# Altium schematic sheet 07) DIGITAL TRANSLATION.SchDoc
size 701 x 447 mm
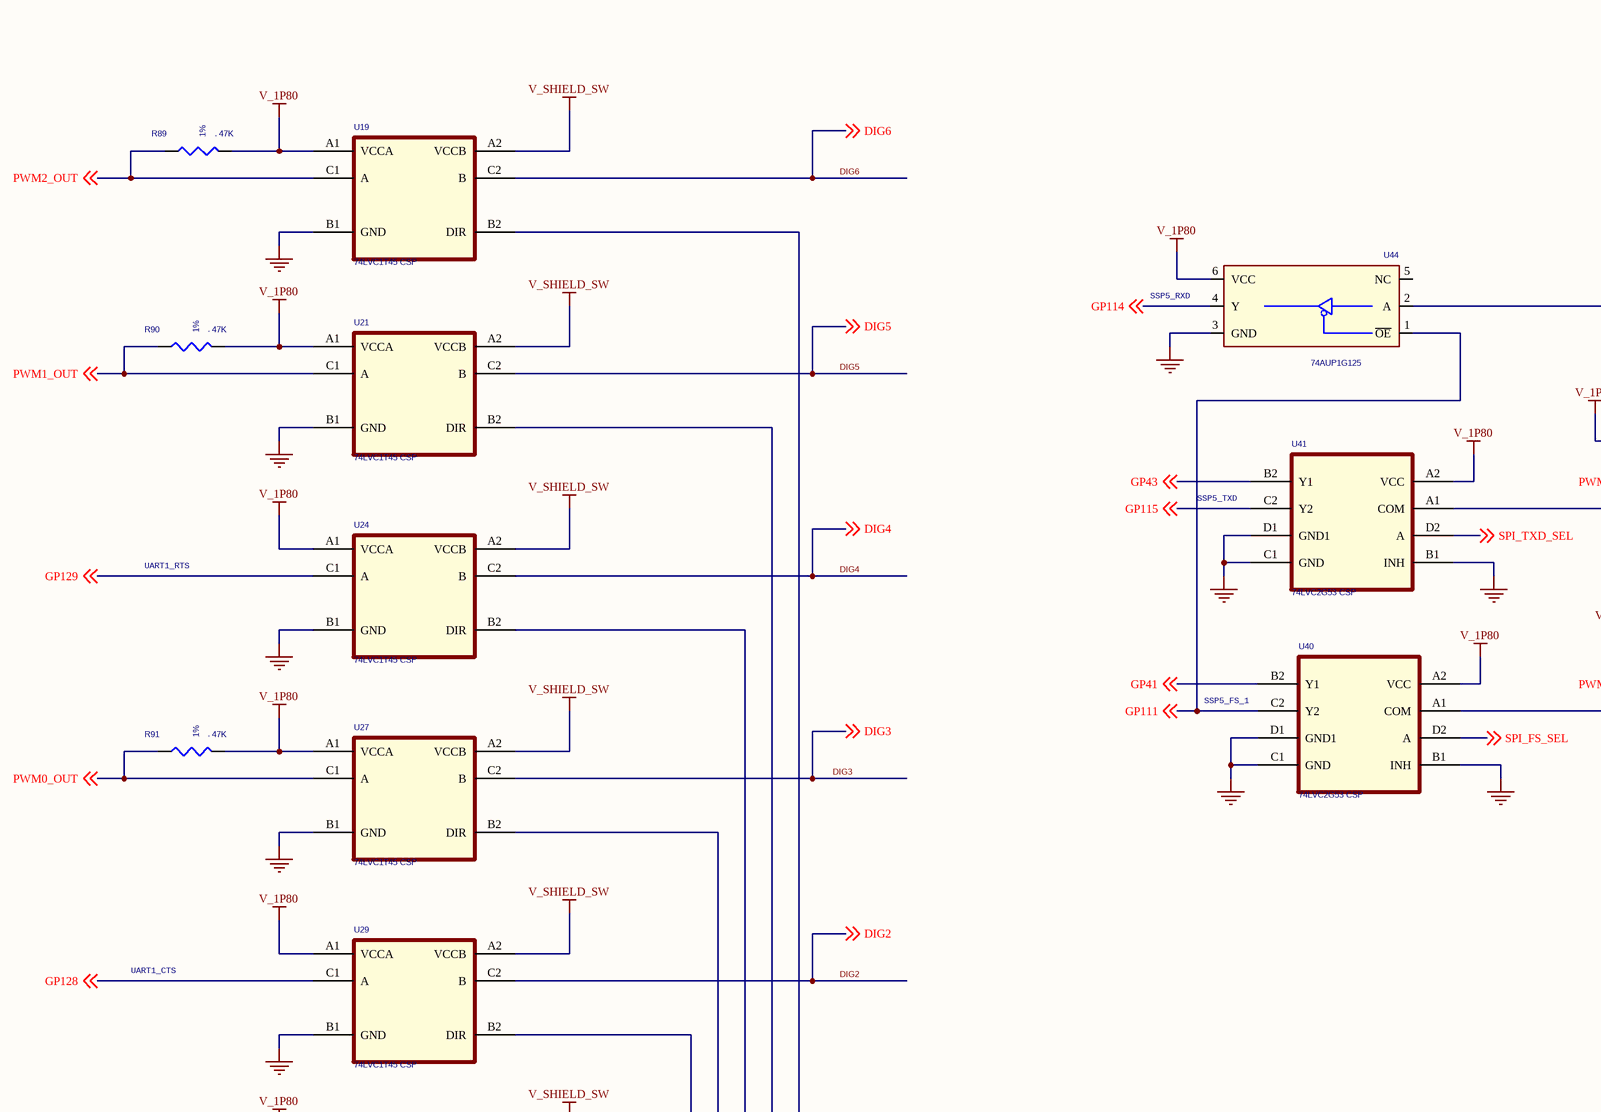
[diagram p0: 07) DIGITAL TRANSLATION.SchDoc, top left]
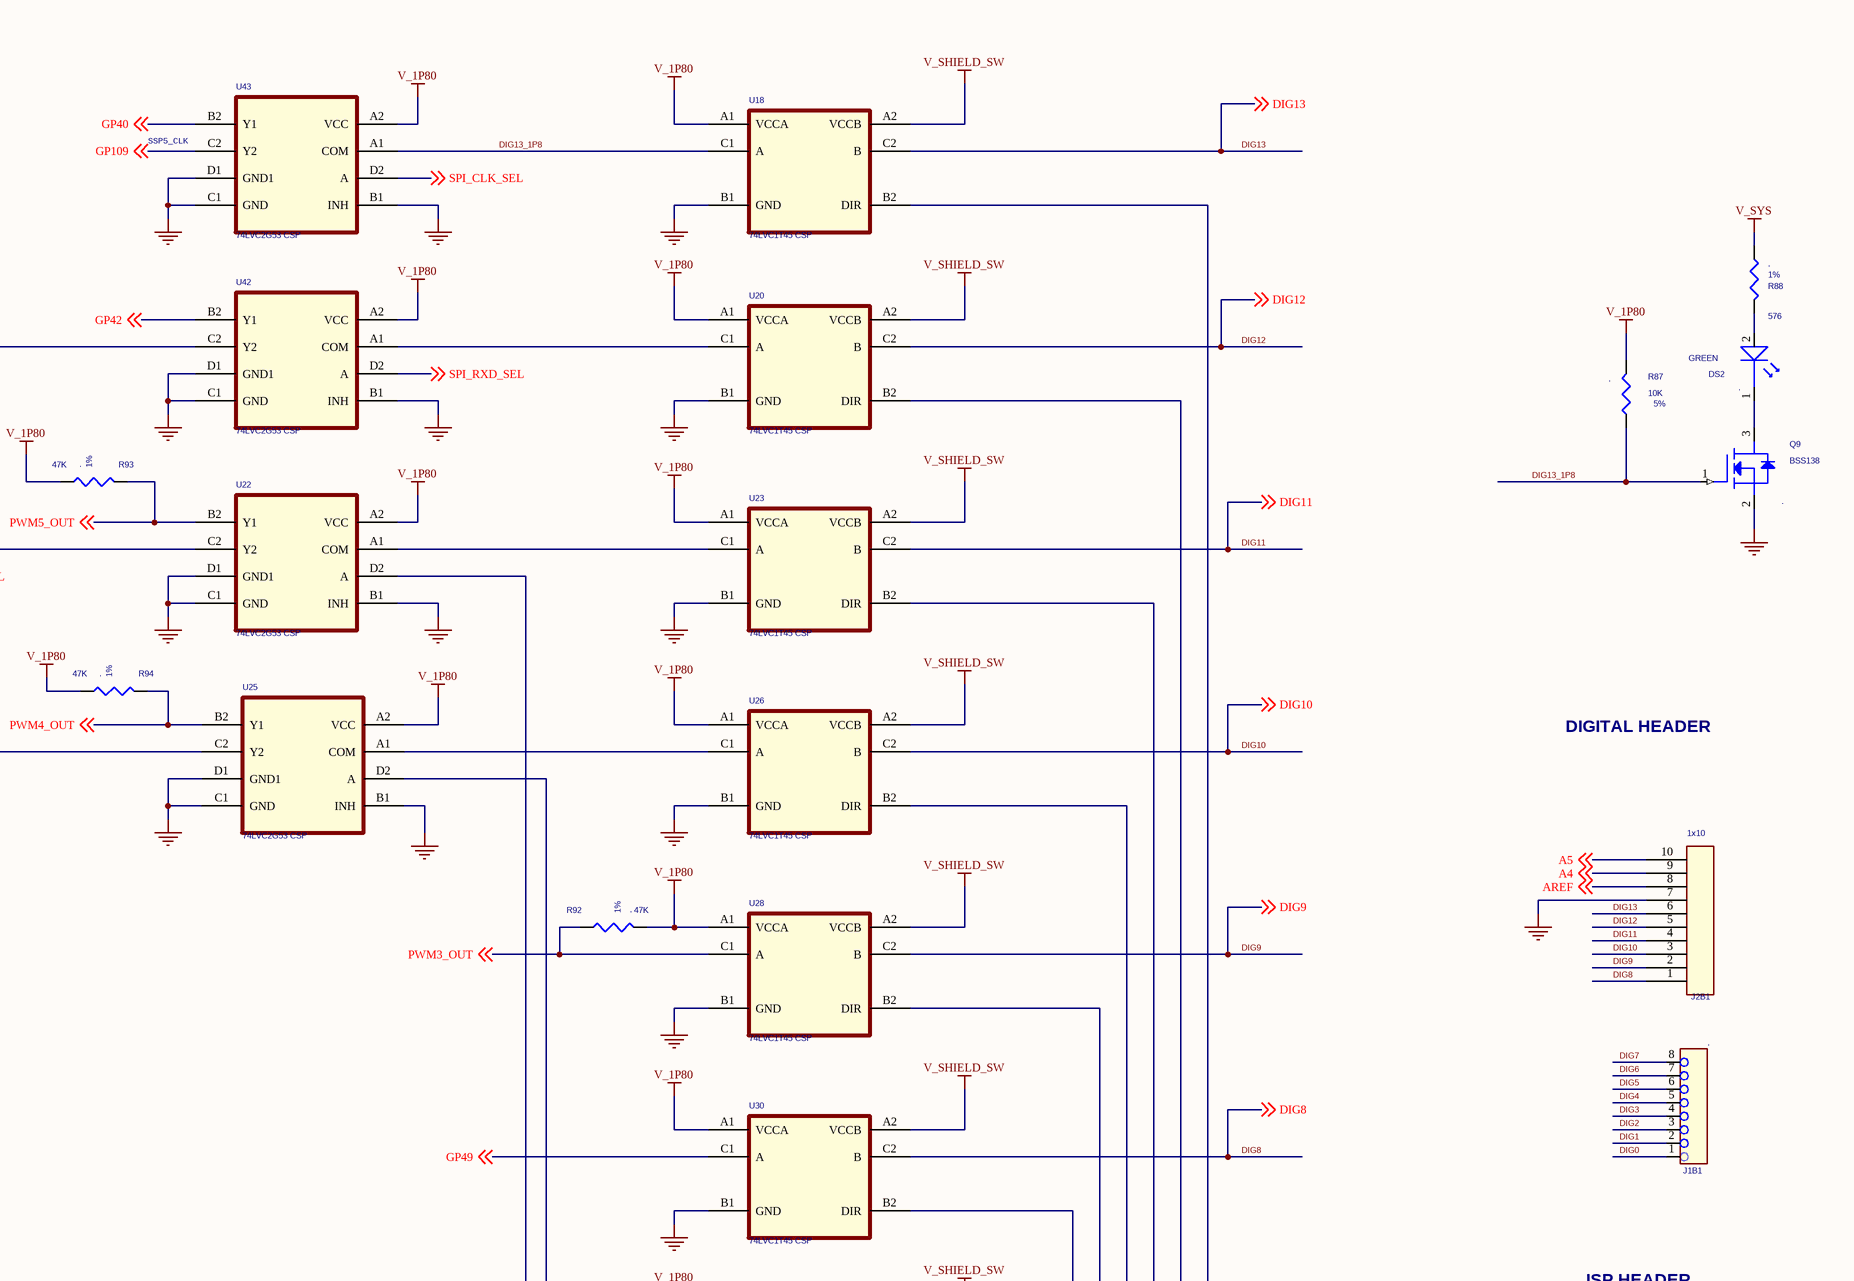
[diagram p1: 07) DIGITAL TRANSLATION.SchDoc, top right]
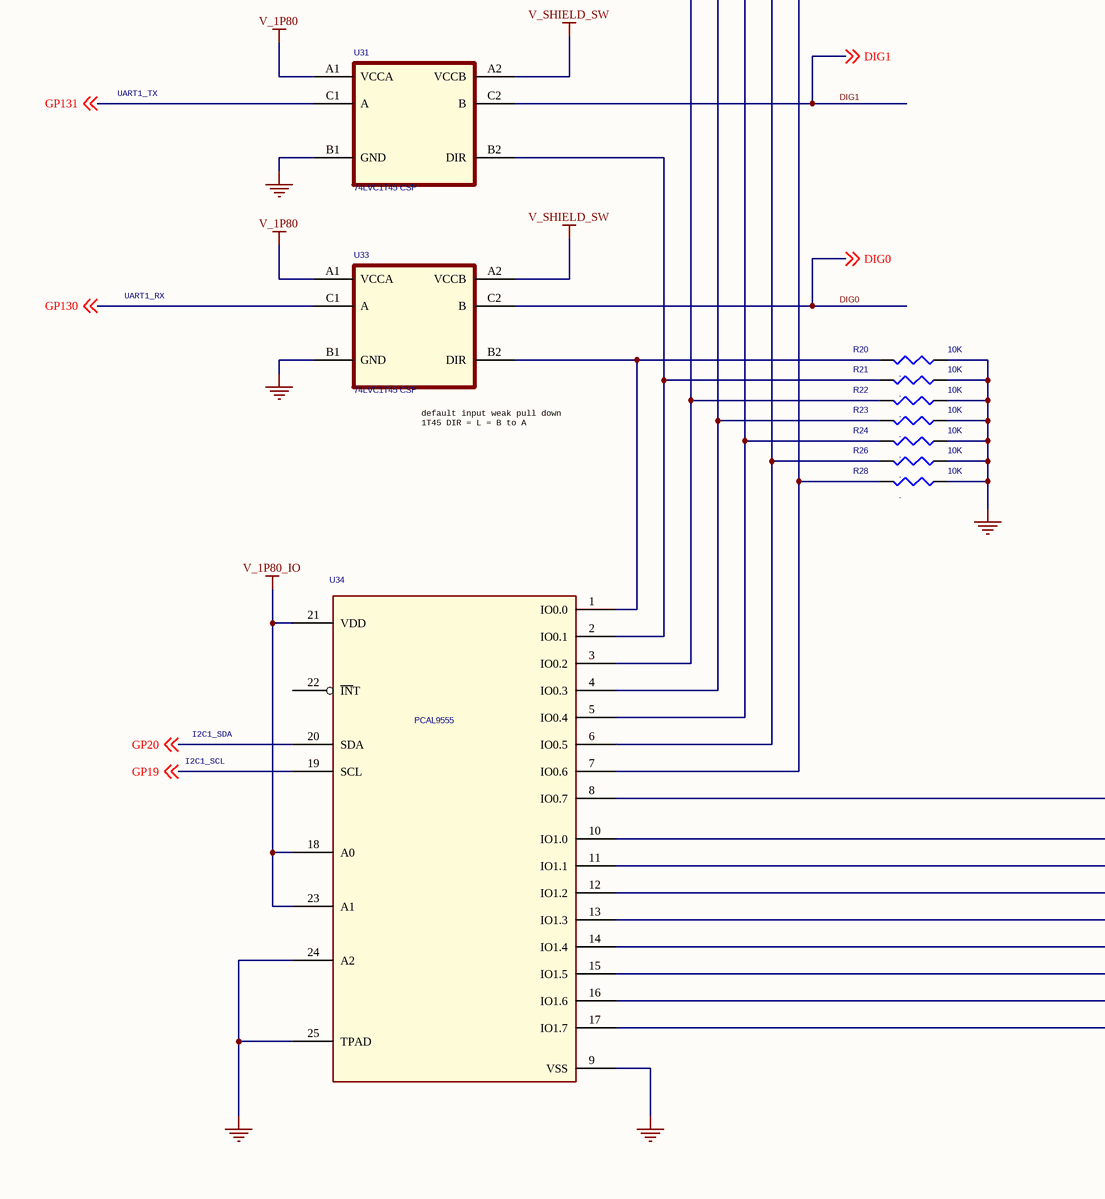
[diagram p2: 07) DIGITAL TRANSLATION.SchDoc, bottom left]
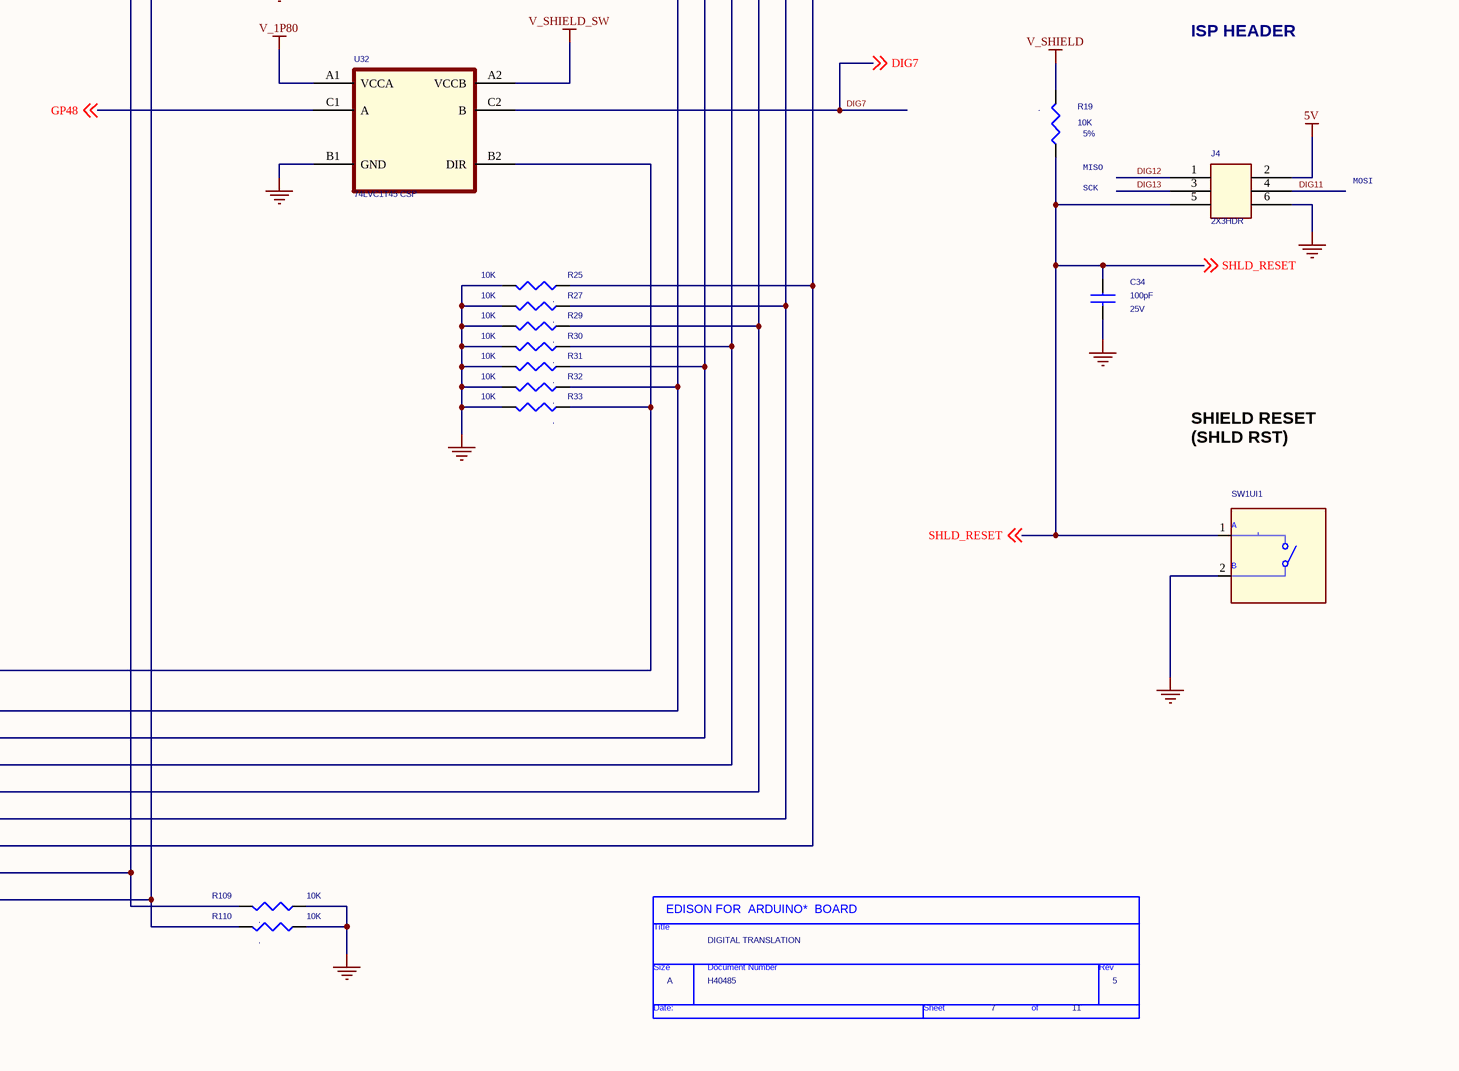
[diagram p3: 07) DIGITAL TRANSLATION.SchDoc, bottom right]

## Parts
*  Page Count: 11  Page Number: 7  Page Size: A  Title: DIGITAL TRANSLATION  RevCode: 5  Doc: H40485  (hidden comment: TitleBlock0)  (graphical)
C34  100pF  RATING: 25V  [SMC0201]
DS2  GREEN  NO_STUFF: .  [smled0402]
J1B1  NO_STUFF: .  [1x8hdr_p100in_th]  (hidden comment: CON8_HDR)
J2B1  1x10  [con10_1x10]
J4  2X3HDR  [HDR_2X3DP]
Q9  BSS138  NO_STUFF: .  [SOT23]
R19  10K  NO_STUFF: .  TOL: 5%  [SMR0201]
R20  10K  NO_STUFF: .  [SMR0201]
R21  10K  NO_STUFF: .  [SMR0201]
R22  10K  NO_STUFF: .  [SMR0201]
R23  10K  NO_STUFF: .  [SMR0201]
R24  10K  NO_STUFF: .  [SMR0201]
R25  10K  NO_STUFF: .  [SMR0201]
R26  10K  NO_STUFF: .  [SMR0201]
R27  10K  NO_STUFF: .  [SMR0201]
R28  10K  NO_STUFF: .  [SMR0201]
R29  10K  NO_STUFF: .  [SMR0201]
R30  10K  NO_STUFF: .  [SMR0201]
R31  10K  NO_STUFF: .  [SMR0201]
R32  10K  NO_STUFF: .  [SMR0201]
R33  10K  NO_STUFF: .  [SMR0201]
R87  10K  NO_STUFF: .  TOL: 5%  [SMR0201]
R88  576  NO_STUFF: .  TOL: 1%  [SMR0201]
R89  47K  TOL: 1%  NO_STUFF: .  [SMR0201]
R90  47K  TOL: 1%  NO_STUFF: .  [SMR0201]
R91  47K  TOL: 1%  NO_STUFF: .  [SMR0201]
R92  47K  TOL: 1%  NO_STUFF: .  [SMR0201]
R93  47K  TOL: 1%  NO_STUFF: .  [SMR0201]
R94  47K  TOL: 1%  NO_STUFF: .  [SMR0201]
R109  10K  NO_STUFF: .  [SMR0201]
R110  10K  NO_STUFF: .  [SMR0201]
SW1UI1  LIGHT TOUCH SWITCH EVQP7J01P  [sw_evqp7_4p]  (value not drawn)
U18  74LVC1T45 CSP  [bga6_5mm_37x57]
U19  74LVC1T45 CSP  [bga6_5mm_37x57]
U20  74LVC1T45 CSP  [bga6_5mm_37x57]
U21  74LVC1T45 CSP  [bga6_5mm_37x57]
U22  74LVC2G53 CSP  [bga8_2X4_P5MM]
U23  74LVC1T45 CSP  [bga6_5mm_37x57]
U24  74LVC1T45 CSP  [bga6_5mm_37x57]
U25  74LVC2G53 CSP  [bga8_2X4_P5MM]
U26  74LVC1T45 CSP  [bga6_5mm_37x57]
U27  74LVC1T45 CSP  [bga6_5mm_37x57]
U28  74LVC1T45 CSP  [bga6_5mm_37x57]
U29  74LVC1T45 CSP  [bga6_5mm_37x57]
U30  74LVC1T45 CSP  [bga6_5mm_37x57]
U31  74LVC1T45 CSP  [bga6_5mm_37x57]
U32  74LVC1T45 CSP  [bga6_5mm_37x57]
U33  74LVC1T45 CSP  [bga6_5mm_37x57]
U34  PCAL9555  [LCC25_S41_5DF89X89MA]
U40  74LVC2G53 CSP  [bga8_2X4_P5MM]
U41  74LVC2G53 CSP  [bga8_2X4_P5MM]
U42  74LVC2G53 CSP  [bga8_2X4_P5MM]
U43  74LVC2G53 CSP  [bga8_2X4_P5MM]
U44  74AUP1G125  [LCC6_P35MM_SQ1P0_NONC_P5H]

## Nets
5V: J4.2(IO_2)
GND: C34.2 J2B1.7 J4.6(IO_6) Q9.2(S) R20.1 R21.1 R22.1 R23.1 R24.1 R25.1 R26.1 R27.1 R28.1 R29.1 R30.1 R31.1 R32.1 R33.1 R109.1 R110.1 SW1UI1.2(B) U18.B1(GND) U19.B1(GND) U20.B1(GND) U21.B1(GND) U22.B1(INH) U22.C1(GND) U22.D1(GND1) U23.B1(GND) U24.B1(GND) U25.B1(INH) U25.C1(GND) U25.D1(GND1) U26.B1(GND) U27.B1(GND) U28.B1(GND) U29.B1(GND) U30.B1(GND) U31.B1(GND) U32.B1(GND) U33.B1(GND) U34.9(VSS) U34.24(A2) U34.25(TPAD) U40.B1(INH) U40.C1(GND) U40.D1(GND1) U41.B1(INH) U41.C1(GND) U41.D1(GND1) U42.B1(INH) U42.C1(GND) U42.D1(GND1) U43.B1(INH) U43.C1(GND) U43.D1(GND1) U44.3(GND)
V_1P80: R87.2 R89.2 R90.2 R91.2 R92.2 R93.2 R94.2 U18.A1(VCCA) U19.A1(VCCA) U20.A1(VCCA) U21.A1(VCCA) U22.A2(VCC) U23.A1(VCCA) U24.A1(VCCA) U25.A2(VCC) U26.A1(VCCA) U27.A1(VCCA) U28.A1(VCCA) U29.A1(VCCA) U30.A1(VCCA) U31.A1(VCCA) U32.A1(VCCA) U33.A1(VCCA) U40.A2(VCC) U41.A2(VCC) U42.A2(VCC) U43.A2(VCC) U44.6(VCC)
V_1P80_IO: U34.18(A0) U34.21(VDD) U34.23(A1)
V_SHIELD: R19.2
V_SHIELD_SW: U18.A2(VCCB) U19.A2(VCCB) U20.A2(VCCB) U21.A2(VCCB) U23.A2(VCCB) U24.A2(VCCB) U26.A2(VCCB) U27.A2(VCCB) U28.A2(VCCB) U29.A2(VCCB) U30.A2(VCCB) U31.A2(VCCB) U32.A2(VCCB) U33.A2(VCCB)
V_SYS: R88.2
A4: J2B1.9 ; off-sheet A4
A5: J2B1.10 ; off-sheet A5
AREF: J2B1.8 ; off-sheet AREF
DIG0: J1B1.1 U33.C2(B) ; off-sheet DIG0
DIG1: J1B1.2 U31.C2(B) ; off-sheet DIG1
DIG2: J1B1.3 U29.C2(B) ; off-sheet DIG2
DIG3: J1B1.4 U27.C2(B) ; off-sheet DIG3
DIG4: J1B1.5 U24.C2(B) ; off-sheet DIG4
DIG5: J1B1.6 U21.C2(B) ; off-sheet DIG5
DIG6: J1B1.7 U19.C2(B) ; off-sheet DIG6
DIG7: J1B1.8 U32.C2(B) ; off-sheet DIG7
DIG8: J2B1.1 U30.C2(B) ; off-sheet DIG8
DIG9: J2B1.2 U28.C2(B) ; off-sheet DIG9
DIG10: J2B1.3 U26.C2(B) ; off-sheet DIG10
DIG11: J2B1.4 J4.4(IO_4) U23.C2(B) ; off-sheet DIG11
DIG12: J2B1.5 J4.1(IO_1) U20.C2(B) ; off-sheet DIG12
DIG13: J2B1.6 J4.3(IO_3) U18.C2(B) ; off-sheet DIG13
DIG13_1P8: Q9.1(G) R87.1 U18.C1(A) U43.A1(COM)
GP19: U34.19(SCL) ; off-sheet GP19
GP20: U34.20(SDA) ; off-sheet GP20
GP40: U43.B2(Y1) ; off-sheet GP40
GP41: U40.B2(Y1) ; off-sheet GP41
GP42: U42.B2(Y1) ; off-sheet GP42
GP43: U41.B2(Y1) ; off-sheet GP43
GP48: U32.C1(A) ; off-sheet GP48
GP49: U30.C1(A) ; off-sheet GP49
GP109: U43.C2(Y2) ; off-sheet GP109
GP111: U40.C2(Y2) U44.1(~{OE}) ; off-sheet GP111
GP114: U44.4(Y) ; off-sheet GP114
GP115: U41.C2(Y2) ; off-sheet GP115
GP128: U29.C1(A) ; off-sheet GP128
GP129: U24.C1(A) ; off-sheet GP129
GP130: U33.C1(A) ; off-sheet GP130
GP131: U31.C1(A) ; off-sheet GP131
PWM0_OUT: R91.1 U27.C1(A) ; off-sheet PWM0_OUT
PWM1_OUT: R90.1 U21.C1(A) ; off-sheet PWM1_OUT
PWM2_OUT: R89.1 U19.C1(A) ; off-sheet PWM2_OUT
PWM3_OUT: R92.1 U28.C1(A) ; off-sheet PWM3_OUT
PWM4_OUT: R94.1 U25.B2(Y1) ; off-sheet PWM4_OUT
PWM5_OUT: R93.1 U22.B2(Y1) ; off-sheet PWM5_OUT
SHLD_RESET: C34.1 J4.5(IO_5) R19.1 SW1UI1.1(A) ; off-sheet SHLD_RESET
SPI_CLK_SEL: U43.D2(A) ; off-sheet SPI_CLK_SEL
SPI_FS_SEL: U40.D2(A) ; off-sheet SPI_FS_SEL
SPI_RXD_SEL: U42.D2(A) ; off-sheet SPI_RXD_SEL
SPI_TXD_SEL: U41.D2(A) ; off-sheet SPI_TXD_SEL
NetDS2_1: DS2.1(LED1) Q9.3(D)
NetDS2_2: DS2.2(LED2) R88.1
NetR20_2: R20.2 U33.B2(DIR) U34.1(IO0.0)
NetR21_2: R21.2 U31.B2(DIR) U34.2(IO0.1)
NetR22_2: R22.2 U29.B2(DIR) U34.3(IO0.2)
NetR23_2: R23.2 U27.B2(DIR) U34.4(IO0.3)
NetR24_2: R24.2 U24.B2(DIR) U34.5(IO0.4)
NetR25_2: R25.2 U18.B2(DIR) U34.15(IO1.5)
NetR26_2: R26.2 U21.B2(DIR) U34.6(IO0.5)
NetR27_2: R27.2 U20.B2(DIR) U34.14(IO1.4)
NetR28_2: R28.2 U19.B2(DIR) U34.7(IO0.6)
NetR29_2: R29.2 U23.B2(DIR) U34.13(IO1.3)
NetR30_2: R30.2 U26.B2(DIR) U34.12(IO1.2)
NetR31_2: R31.2 U28.B2(DIR) U34.11(IO1.1)
NetR32_2: R32.2 U30.B2(DIR) U34.10(IO1.0)
NetR33_2: R33.2 U32.B2(DIR) U34.8(IO0.7)
NetR109_2: R109.2 U22.D2(A) U34.16(IO1.6)
NetR110_2: R110.2 U25.D2(A) U34.17(IO1.7)
NetU20_C1: U20.C1(A) U42.A1(COM)
NetU22_A1: U22.A1(COM) U23.C1(A)
NetU22_C2: U22.C2(Y2) U41.A1(COM)
NetU25_A1: U25.A1(COM) U26.C1(A)
NetU25_C2: U25.C2(Y2) U40.A1(COM)
NetU42_C2: U42.C2(Y2) U44.2(A)

Not connected (* = marked no-connect by the designer): U34 22(~{IN}T); U44 5(NC)

## Notes on the sheet
- (near U43) SSP5_CLK
- (near U44) SSP5_RXD
- SSP5_TXD
- UART1_RTS
- DIGITAL HEADER
- SSP5_FS_1
- UART1_CTS
- UART1_TX
- ISP HEADER
- UART1_RX
- (near R19) MISO
- (near R19) SCK
- MOSI
- (near U33) default input weak pull down
  1T45 DIR = L = B to A
- SHIELD RESET
  (SHLD RST)
- I2C1_SCL
- I2C1_SDA
- (in symbol TitleBlock0) EDISON FOR  ARDUINO*  BOARD; Title; Size; Document Number; Rev; Date:; Sheet; of

## Library data of the parts
C34 = CAPC,COG,0201,25V,5%,100pF: CAPC,C0G,0201,100.000PF,25.000V,+/- 5%; PART_NUMBER: D70542-001; NO_STUFF: .; LEAD_FREE: YES; BOM: x; ROOM: BATTERY; IPN: D70542-001; Device: D70542-001; FINANCE: x
DS2 = LED,SMT,GREEN,V,0402: LED,1005,SM,GRN,V,1.00,RC,1; Device: E54986-003; LEAD_FREE: YES; BOM: x; IPN: E54986-003; PART_NUMBER: E54986-003; FINANCE: x
J1B1 = CON8,HDR,TH,0.1in,E70026-001: CONN,PLUG,VERT,1X8,2.54MM,THM,90147_1108; FINANCE: x; LEAD_FREE: YES; IPN: H46118-001; BOM: x; Device: H46118-001; PART_NUMBER: H46118-001
J2B1 = CON10,1X10,0.1,0.093,E74918-001: CONN,PLUG,VERT,1X10,2.54MM,THM,10CIRCUITS,90147_1110; ROOM: NO_ROOM; NO_STUFF: .; LEAD_FREE: YES; IPN: H46116-001; PART_NUMBER: H46116-001; PART NUMBER: H46116-001
J4 = CON6,HDR,TH,0_0.1,C77978-007: CONN,HDR,2X3,PLG,VT,0.1,0.93 ST; PART_NUMBER: H18587-001; FINANCE: x; LEAD_FREE: YES; NO_STUFF: .; BOM: x; IPN: H18587-001; Device: H18587-001
Q9 = XSTR,BSS138,FET,NCH,SOT23: IC,DS,FET N,SOT-23,BSS138LT3G; FINANCE: x; LEAD_FREE: YES; Device: C81974-001; BOM: x; IPN: C81974-001; PART_NUMBER: C81974-001
R19 R87 = RESD,0201,5%,1/20W,10K: RES D,0201,10.00 kOHM,5.00%,1/20W,YES; Device: C80792-002; BOM: x; ROOM: AUDIO_CODEC; RATING: 1/20W; IPN: C80792-002; PART_NUMBER: C80792-002; LEAD_FREE: YES; FINANCE: x
R20-R33 R109 R110 = RESD,0201,5%,1/20W,10K: RES D,0201,10.00 kOHM,5.00%,1/20W,YES; Device: C80792-002; TOL: 5%; BOM: x; ROOM: AUDIO_CODEC; RATING: 1/20W; IPN: C80792-002; PART_NUMBER: C80792-002; LEAD_FREE: YES; FINANCE: x
R88 = RESD,0201,1%,1/20W,562: RES D,0402,576.00 OHM,1.00%,1/16W,YES; PART_NUMBER: A93548-403; RATING: 1/20W; BOM: x; LEAD_FREE: YES; FINANCE: x
R89-R94 = RESD,0201,1%,1/20W,47K: RES_D,0201,47.0kOHM,1.00%,1/20W,; PART_NUMBER: C48657-118; FINANCE: x; LEAD_FREE: YES; BOM: x; IPN: C48657-118; RATING: 1/20W; Device: C48657-118
SW1UI1 = SWITCH,EVQP7J01P,4P,PWR_0: CONN,SWIT,TACTILE,VT,SPST,2,50.0 mA,SMT>; PART_NUMBER: D90553-001; MFG: Panasonic; BOM: x; ROOM: UI_BUTTONS; NO_STUFF: .; LEAD_FREE: YES; MFG P/N: EVQP7J01P; IPN: D90553-001; FINANCE: x; DEVICE: D90553-001
U18-U21 U23 U24 U26-U33 = IC,74LVC1T45,LOG,BGA6,TRNSSVR: IC,LOG,TRANSCEIVE,CSP,SN74LVC1T45,NI3S,; FINANCE: x; LEAD_FREE: YES; IPN: G42189-001; NO_STUFF: .; MFG: TI; MFG P/N: 74LVC1T45YZPR; BOM: x; DEVICE: G42189-001; PART_NUMBER: G42189-001
U22 U25 U40-U43 = IC,74LVC2G53: IC,LOG,MULTIPLEX,uBGA,742G53,NI,; PART_NUMBER: H40914-001; FINANCE: x; LEAD_FREE: YES; IPN: NEED; NO_STUFF: .; MFG: TI; BOM: x; DEVICE: LVC2G53; MFG P/N: 74LVC2G53
U34 = IC,PCAL9555,16bit_GPIO: IC,LIN,INTFC,QFN,PCAL9555,GPIO,; NO_STUFF: .; DEVICE: H31921-001; LEAD_FREE: YES; BOM: x; IPN: H31921-001; Part_Number: H31921-001; FINANCE: x; PART NUMBER: H31921-001
U44 = IC,74AUP1G125,LOG,LCC6,BUFFER: IC,LOG,TRANSCEIVE,DFN,74AUP1G125,NI3S,; ROOM: NO_ROOM; FINANCE: x; LEAD_FREE: YES; IPN: H22984-001; MFG: TI; MFG P/N: 74AUP1G125GF; NO_STUFF: .; BOM: x; DEVICE: H22984-001; PART_NUMBER: H22984-001
* = TitleBlock0: Page Create Date: March  8, 1995